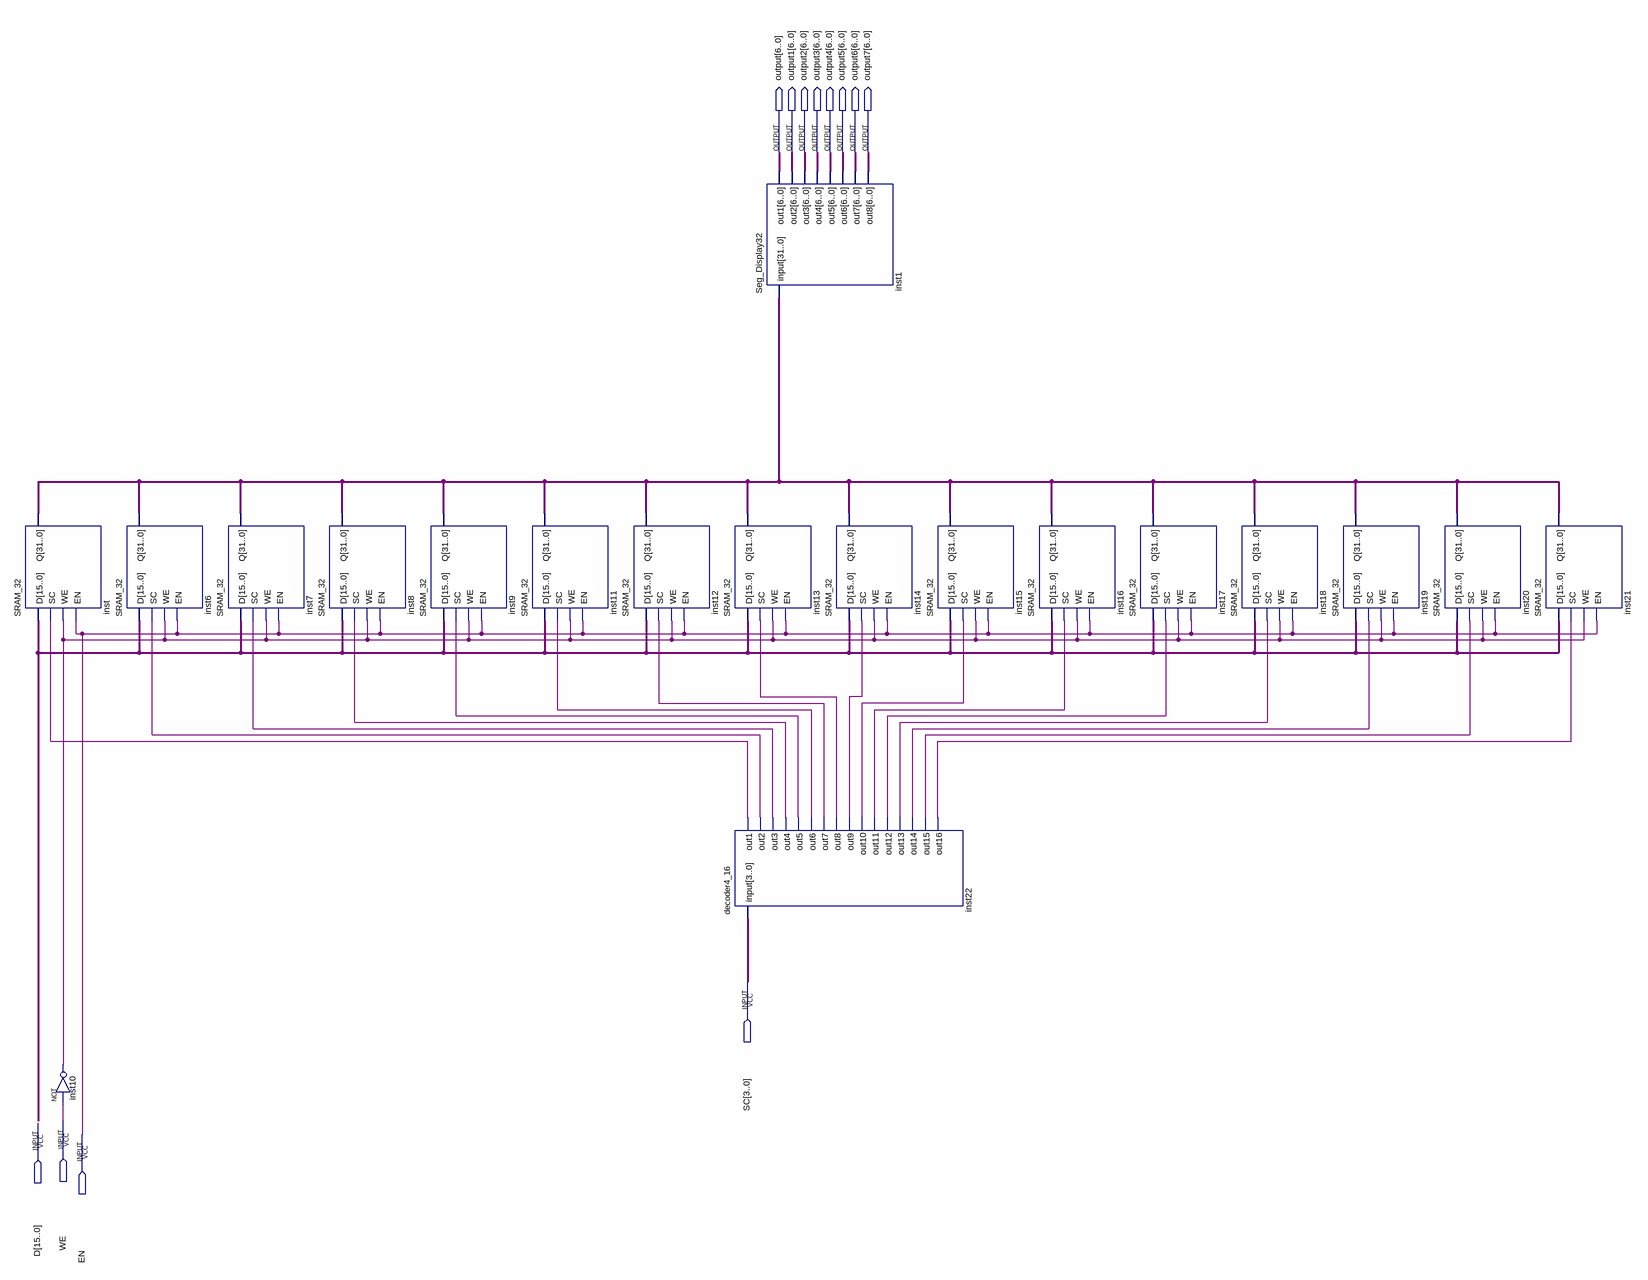
[diagram p0: schematic sheet]
// Quartus schematic Block_SRAM32.bdf as structural Verilog: 19 symbols, 12 pins
module Block_SRAM32 (
  input  [3:0] SC,
  input  [15:0] D,
  input  WE,
  input  EN,
  output [6:0] \output ,
  output [6:0] output1,
  output [6:0] output2,
  output [6:0] output3,
  output [6:0] output4,
  output [6:0] output5,
  output [6:0] output6,
  output [6:0] output7
);

  wire inst10_out, inst22_out1, inst22_out2, inst22_out3, inst22_out4, inst22_out5, inst22_out6, inst22_out7,
       inst22_out8, inst22_out9, inst22_out10, inst22_out11, inst22_out12, inst22_out13, inst22_out14,
       inst22_out15, inst22_out16;
  wire [31:0] inst_q;

  SRAM_32 inst (.D(D), .SC(inst22_out1), .WE(inst10_out), .EN(EN), .Q(inst_q));
  not inst10 (inst10_out, WE);
  SRAM_32 inst6 (.D(D), .SC(inst22_out2), .WE(inst10_out), .EN(EN), .Q(inst_q));
  SRAM_32 inst7 (.D(D), .SC(inst22_out3), .WE(inst10_out), .EN(EN), .Q(inst_q));
  SRAM_32 inst8 (.D(D), .SC(inst22_out4), .WE(inst10_out), .EN(EN), .Q(inst_q));
  SRAM_32 inst9 (.D(D), .SC(inst22_out5), .WE(inst10_out), .EN(EN), .Q(inst_q));
  SRAM_32 inst11 (.D(D), .SC(inst22_out6), .WE(inst10_out), .EN(EN), .Q(inst_q));
  SRAM_32 inst12 (.D(D), .SC(inst22_out7), .WE(inst10_out), .EN(EN), .Q(inst_q));
  Seg_Display32 inst1 (
    .\input (inst_q), .out1(\output ), .out2(output1), .out3(output2), .out4(output3), .out5(output4),
    .out6(output5), .out7(output6), .out8(output7));
  SRAM_32 inst13 (.D(D), .SC(inst22_out8), .WE(inst10_out), .EN(EN), .Q(inst_q));
  decoder4_16 inst22 (
    .\input (SC), .out1(inst22_out1), .out2(inst22_out2), .out3(inst22_out3), .out4(inst22_out4),
    .out5(inst22_out5), .out6(inst22_out6), .out7(inst22_out7), .out8(inst22_out8), .out9(inst22_out9),
    .out10(inst22_out10), .out11(inst22_out11), .out12(inst22_out12), .out13(inst22_out13),
    .out14(inst22_out14), .out15(inst22_out15), .out16(inst22_out16));
  SRAM_32 inst14 (.D(D), .SC(inst22_out9), .WE(inst10_out), .EN(EN), .Q(inst_q));
  SRAM_32 inst15 (.D(D), .SC(inst22_out10), .WE(inst10_out), .EN(EN), .Q(inst_q));
  SRAM_32 inst16 (.D(D), .SC(inst22_out11), .WE(inst10_out), .EN(EN), .Q(inst_q));
  SRAM_32 inst17 (.D(D), .SC(inst22_out12), .WE(inst10_out), .EN(EN), .Q(inst_q));
  SRAM_32 inst18 (.D(D), .SC(inst22_out13), .WE(inst10_out), .EN(EN), .Q(inst_q));
  SRAM_32 inst19 (.D(D), .SC(inst22_out14), .WE(inst10_out), .EN(EN), .Q(inst_q));
  SRAM_32 inst20 (.D(D), .SC(inst22_out15), .WE(inst10_out), .EN(EN), .Q(inst_q));
  SRAM_32 inst21 (.D(D), .SC(inst22_out16), .WE(inst10_out), .EN(EN), .Q(inst_q));
endmodule
